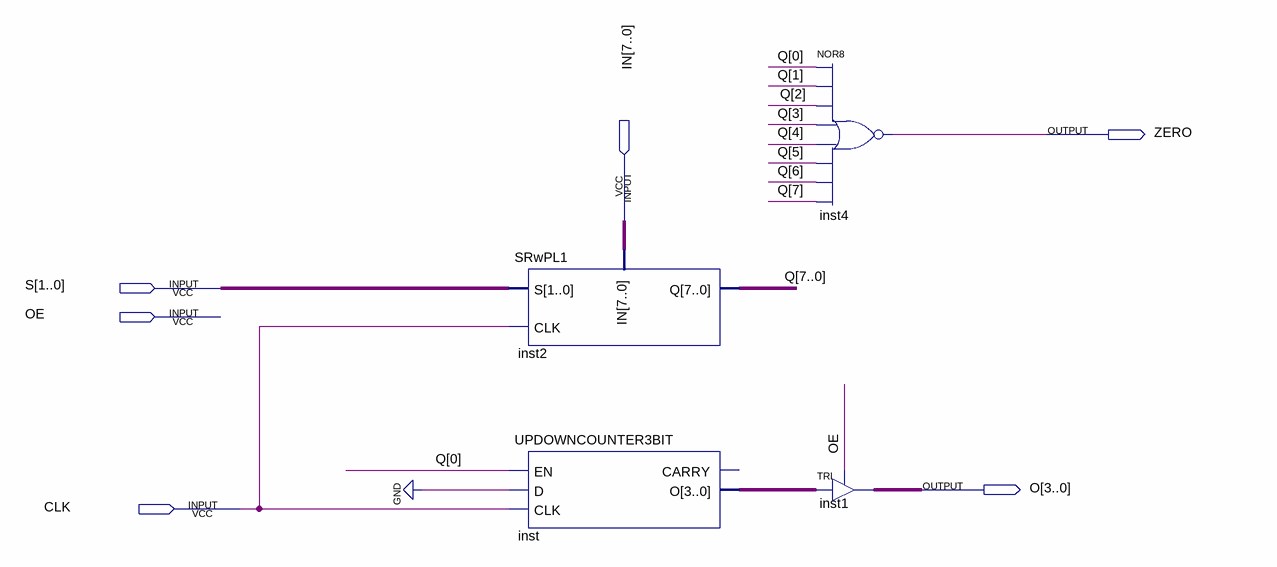
[diagram p0: schematic sheet]
// Quartus schematic DATAPATH.bdf as structural Verilog: 4 symbols, 6 pins
module DATAPATH (
  input  [7:0] IN,
  input  [1:0] S,
  input  OE,
  input  CLK,
  output ZERO,
  output [3:0] O
);

  wire [3:0] inst_o;
  wire [7:0] Q;

  SRwPL1 inst2 (.S(S), .IN(IN), .CLK(CLK), .Q(Q));
  UPDOWNCOUNTER3BIT inst (.EN(Q[0]), .D(1'b0), .CLK(CLK), .O(inst_o));  // open: CARRY
  nor inst4 (ZERO, Q[0], Q[1], Q[2], Q[3], Q[4], Q[5], Q[6], Q[7]);
  TRI inst1[3:0] (.IN(inst_o), .OE(OE), .OUT(O));
endmodule
